# Altium schematic sheet STM32原理图.SchDoc
size A3
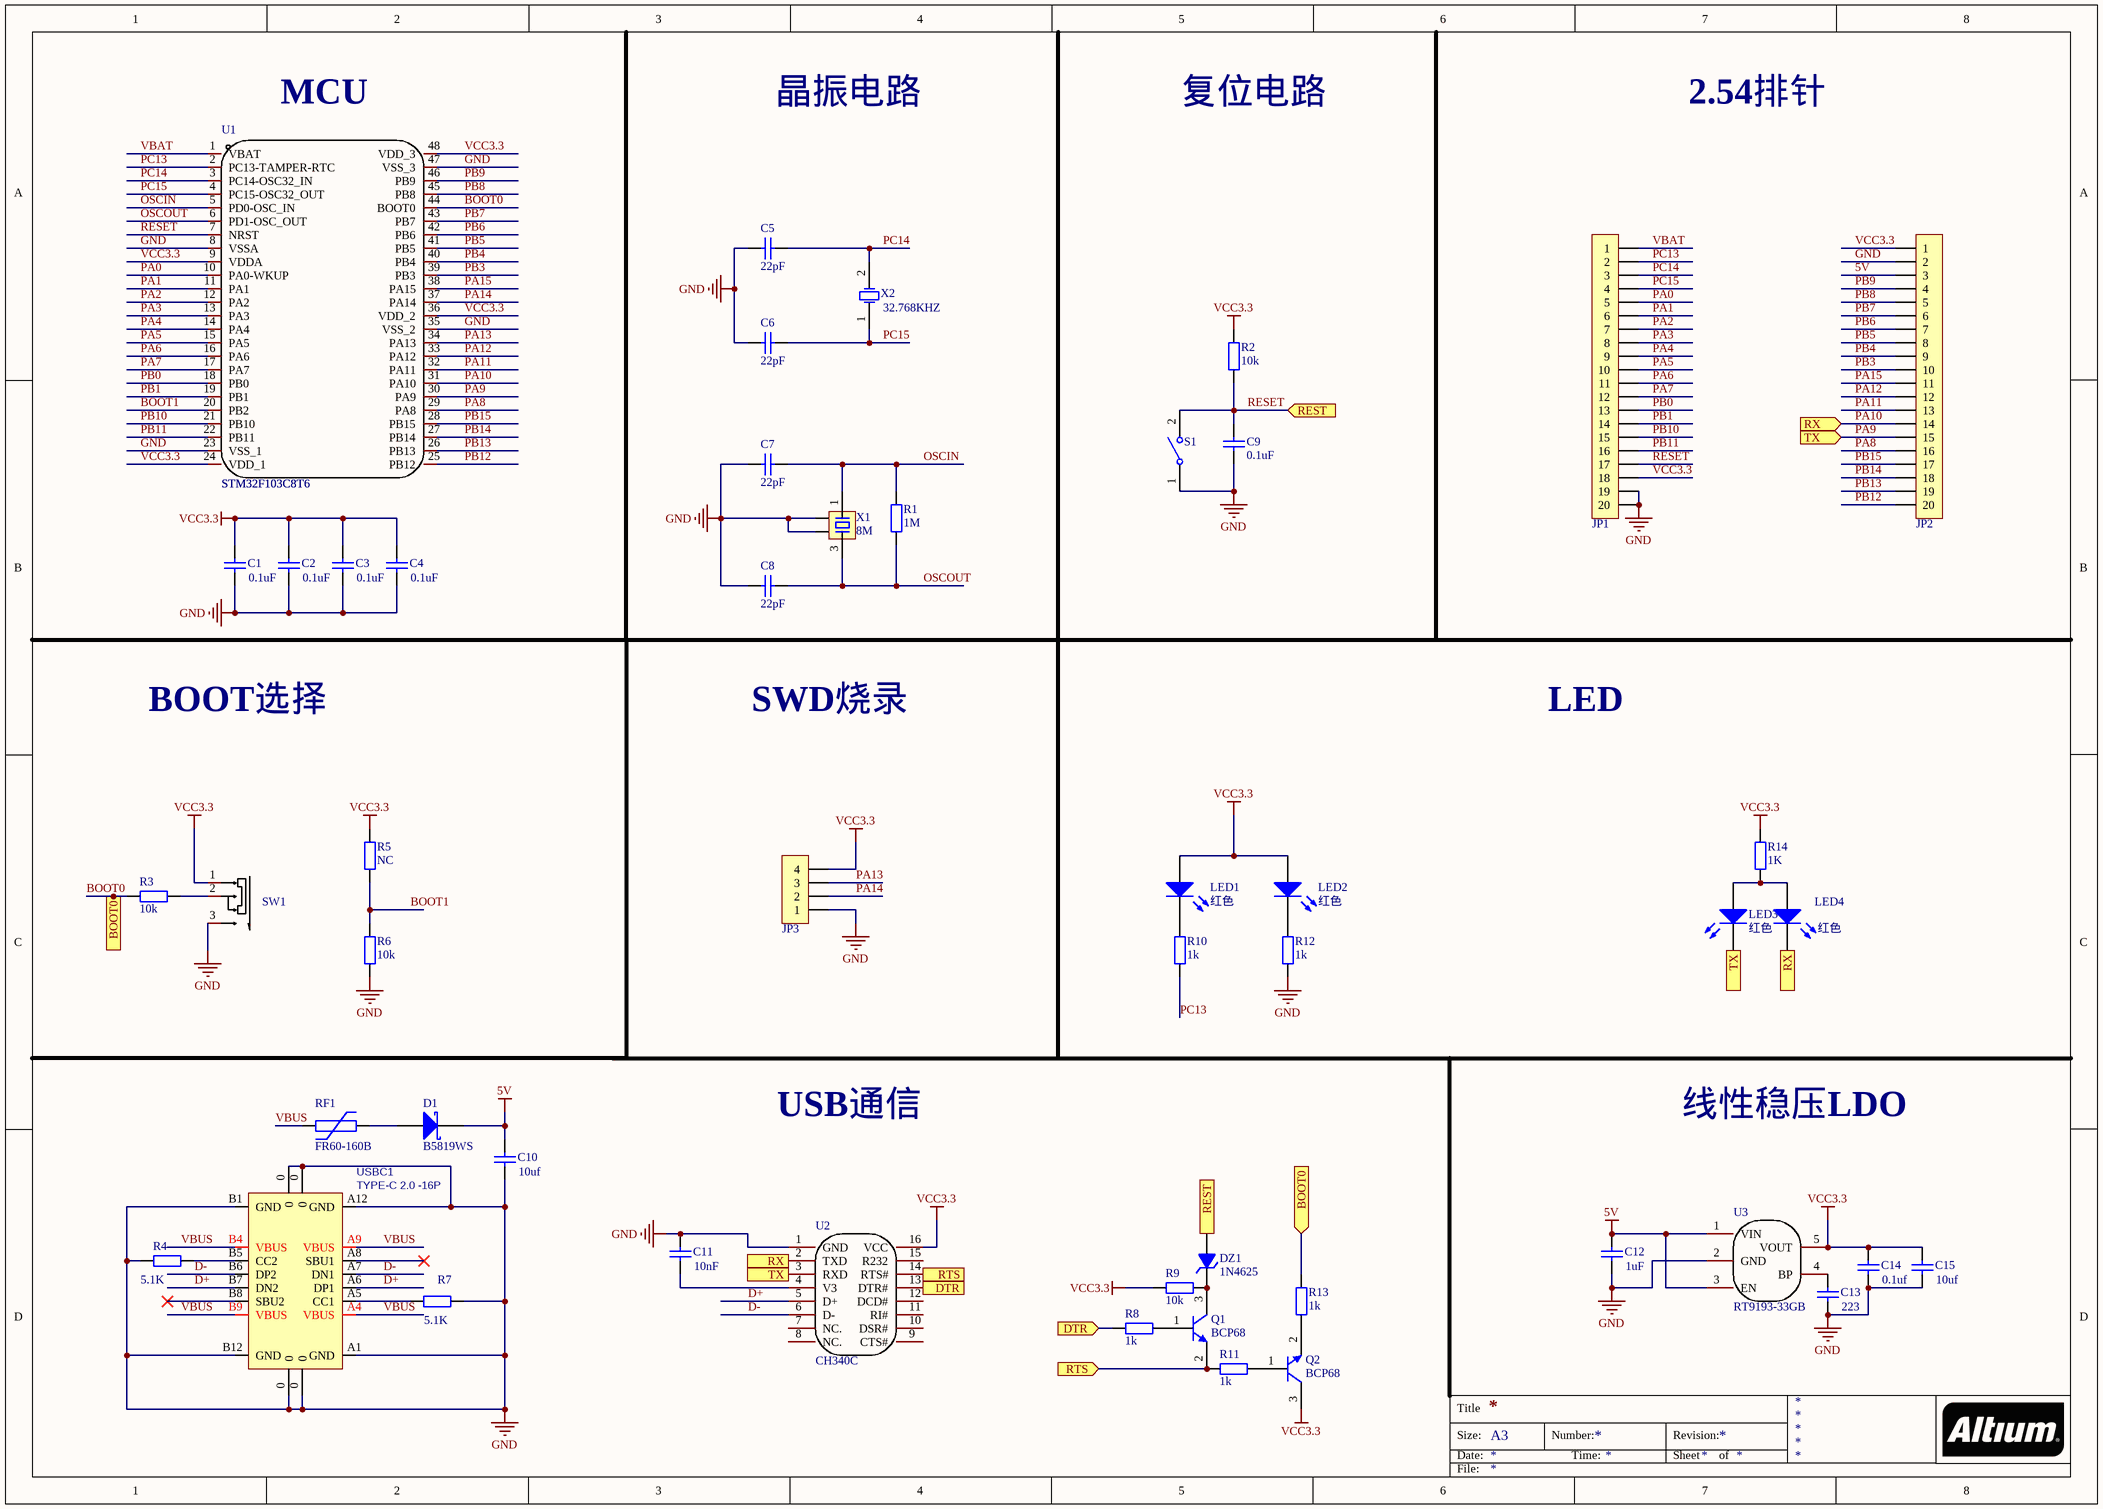
[diagram p0: STM32原理图.SchDoc]

## Parts
C1  value 0.1uF  [C0805_L]  (hidden comment: Cap)
C2  value 0.1uF  [C0805_L]  (hidden comment: Cap)
C3  value 0.1uF  [C0805_L]  (hidden comment: Cap)
C4  value 0.1uF  [C0805_L]  (hidden comment: Cap)
C5  value 22pF  [C0603_L]  (hidden comment: Cap)
C6  value 22pF  [C0603_L]  (hidden comment: Cap)
C7  value 22pF  [C0603_L]  (hidden comment: Cap)
C8  value 22pF  [C0603_L]  (hidden comment: Cap)
C9  value 0.1uF  [C0805_L]  (hidden comment: Cap)
C10  value 10uf  [C0402_M]  (hidden comment: Cap)
C11  value 10nF  [C0402_M]  (hidden comment: Cap)
C12  value 1uF  [C0805_L]  (hidden comment: Cap)
C13  value 223  [C0805_L]  (hidden comment: Cap)
C14  value 0.1uf  [C0603_L]  (hidden comment: Cap)
C15  value 10uf  [C0402_M]  (hidden comment: Cap)
D1  B5819WS  [SOD-323]
DZ1  1N4625  [SOT323]
JP1  HDR-1X20  [HDR2.54-LI-20P]  (value not drawn)
JP2  HDR-1X20  [HDR2.54-LI-20P]  (value not drawn)
JP3  CON-4P  [HDR2.54-M-LI-4P]  (value not drawn)
LED1  红色  [LED0603_Y]
LED2  红色  [LED0603_Y]
LED3  红色  [LED0603_Y]
LED4  红色  [LED0603_G]
Q1  BCP68  [SOT23-3M]
Q2  BCP68  [SOT23-3M]
R1  1M  [R0603_M]
R2  10k  [R0603_M]
R3  10k  [R0603_M]
R4  5.1K  [R0603_M]
R5  NC  [R0603_M]
R6  10k  [R0603_M]
R7  5.1K  [R0603_M]
R8  1k  [R0603_M]
R9  10k  [R0603_M]
R10  1k  [R0402_NS]
R11  1k  [R0603_M]
R12  1k  [R0402_NS]
R13  1k  [R0603_M]
R14  1K  [R0402_NS]
RF1  FR60-160B  [FU 1812]
S1  KCD1-101  [SW SMD-3*6*2.5]  (value not drawn)
SW1  MSS3-Q-T/R  [MSS3-Q-T/R]  (value not drawn)
U1  STM32F103C8T6  [STM32F103C8T6-D]
U2  CH340C  [SOP-16_L10.0-W3.9-P1.27-LS6.0-BL]
U3  RT9193-33GB  [SOT-23-5_L3.0-W1.7-P0.95-LS2.8-BR]
USBC1  TYPE-C 2.0 -16P  [USB-C-SMD_16P]
X1  8M  [XTAL-5032-4P]
X2  32.768KHZ  [XTAL-3215-2P]

## Ports
BOOT0 (in), DTR (in), REST (in), RTS (in), RX (in), TX (in)

## Nets
5V: C10.2 C12.2 D1.2(K) JP2.3 U3.1(VIN) U3.3(EN)
GND: C1.1 C2.1 C3.1 C4.1 C5.2 C6.2 C7.2 C8.2 C9.2 C10.1 C11.2 C12.1 C13.1 C14.1 C15.1 JP1.19 JP1.20 JP2.2 JP3.1 R4.1 R6.2 R7.2 R12.2 S1.1 SW1.3 U1.8(VSSA) U1.23(VSS_1) U1.35(VSS_2) U1.47(VSS_3) U2.1(GND) U3.2(GND) USBC1.0 USBC1.A1(GND) USBC1.A12(GND) USBC1.B1(GND) USBC1.B12(GND) X1.2 X1.4
VCC3.3: C1.2 C2.2 C3.2 C4.2 C14.2 C15.2 JP1.18 JP2.1 JP3.4 LED1.1(A) LED2.1(A) Q2.3(C) R2.2 R5.1 R9.1 R14.1 SW1.1 U1.9(VDDA) U1.24(VDD_1) U1.36(VDD_2) U1.48(VDD_3) U2.16(VCC) U3.5(VOUT)
BOOT0: R3.2 R13.2 U1.44(BOOT0) ; port BOOT0
BOOT1: R5.2 R6.1 U1.20(PB2)
D+: U2.5(D+) USBC1.A6(DP1) USBC1.B7(DN2)
D-: U2.6(D-) USBC1.A7(DN1) USBC1.B6(DP2)
DTR: R8.1 U2.13(DTR#) ; port DTR
OSCIN: C7.1 R1.2 U1.5(PD0-OSC_IN) X1.1
OSCOUT: C8.1 R1.1 U1.6(PD1-OSC_OUT) X1.3
PA0: JP1.5 U1.10(PA0-WKUP)
PA1: JP1.6 U1.11(PA1)
PA2: JP1.7 U1.12(PA2)
PA3: JP1.8 U1.13(PA3)
PA4: JP1.9 U1.14(PA4)
PA5: JP1.10 U1.15(PA5)
PA6: JP1.11 U1.16(PA6)
PA7: JP1.12 U1.17(PA7)
PA8: JP2.16 U1.29(PA8)
PA9: JP2.15 LED3.2(K) U1.30(PA9) U2.3(RXD) ; port TX
PA10: JP2.14 LED4.2(K) U1.31(PA10) U2.2(TXD) ; port RX
PA11: JP2.13 U1.32(PA11)
PA12: JP2.12 U1.33(PA12)
PA13: JP3.3 U1.34(PA13)
PA14: JP3.2 U1.37(PA14)
PA15: JP2.11 U1.38(PA15)
PB0: JP1.13 U1.18(PB0)
PB1: JP1.14 U1.19(PB1)
PB3: JP2.10 U1.39(PB3)
PB4: JP2.9 U1.40(PB4)
PB5: JP2.8 U1.41(PB5)
PB6: JP2.7 U1.42(PB6)
PB7: JP2.6 U1.43(PB7)
PB8: JP2.5 U1.45(PB8)
PB9: JP2.4 U1.46(PB9)
PB10: JP1.15 U1.21(PB10)
PB11: JP1.16 U1.22(PB11)
PB12: JP2.20 U1.25(PB12)
PB13: JP2.19 U1.26(PB13)
PB14: JP2.18 U1.27(PB14)
PB15: JP2.17 U1.28(PB15)
PC13: JP1.2 R10.2 U1.2(PC13-TAMPER-RTC)
PC14: C5.1 JP1.3 U1.3(PC14-OSC32_IN) X2.2(OSC2)
PC15: C6.1 JP1.4 U1.4(PC15-OSC32_OUT) X2.1(OSC1)
RESET: C9.1 DZ1.1(A) JP1.17 R2.1 S1.2 U1.7(NRST) ; port REST
RTS: Q1.2(E) R11.1 U2.14(RTS#) ; port RTS
VBAT: JP1.1 U1.1(VBAT)
VBUS: RF1.1 USBC1.A4(VBUS) USBC1.A9(VBUS) USBC1.B4(VBUS) USBC1.B9(VBUS)
NetC11_1: C11.1 U2.4(V3)
NetC13_2: C13.2 U3.4(BP)
NetD1_1: D1.1(A) RF1.2
NetDZ1_2: DZ1.2(K) Q1.3(C) R9.2
NetLED1_2: LED1.2(K) R10.1
NetLED2_2: LED2.2(K) R12.1
NetLED3_1: LED3.1(A) LED4.1(A) R14.2
NetQ1_1: Q1.1(B) R8.2
NetQ2_1: Q2.1(B) R11.2
NetQ2_2: Q2.2(E) R13.1
NetR3_1: R3.1 SW1.2
NetR4_2: R4.2 USBC1.B5(CC2)
NetR7_1: R7.1 USBC1.A5(CC1)

Not connected (* = marked no-connect by the designer): U2 7(NC.) 8(NC.) 9(CTS#) 10(DSR#) 11(RI#) 12(DCD#) 15(R232); USBC1 A8(SBU1)* B8(SBU2)*

## Notes on the sheet
- (near U1) MCU
- 晶振电路
- 复位电路
- 2.54排针
- BOOT选择
- SWD烧录
- LED
- USB通信
- 线性稳压LDO
- Title
- Size:
- Date:
- A3
- Number:
- Time:
- Revision:
- Sheet
- of
- File:

## Library data of the parts
C1-C15 = Cap: Capacitor; Published: 8-Jun-2000; LatestRevisionDate: 17-Jul-2002; LatestRevisionNote: Re-released for DXP Platform.; PackageReference: RAD-0.3; Publisher: Altium Limited; PackageDescription: Radial Cap, Thru-Hole; 2 Leads; 0.3 in Pin Spacing
D1 = 1N5819: 肖特基二极管; 以赠品形式获赠本封装库的买家，还可联系卖家免费指导AD软件使用: 封装库来自淘宝卖家ID：黄晶宝石; BOM名称: 肖特基二极管
DZ1 = 1N4625: 5.1V/0.5W稳压管; 以赠品形式获赠本封装库的买家，还可联系卖家免费指导AD软件使用: 封装库来自淘宝卖家ID：黄晶宝石; BOM名称: 5.1V/0.5W稳压管
JP1 JP2 = Header 20: 20P接插件; 联系卖家，免费查找封装: 唯一出售店铺网址https://shop463601444.taobao.com; 封装库来自淘宝卖家ID：黄晶宝石: 其他店铺购入均为盗版封装库，请立即申请退款，本店现金奖励50~200元; BOM名称: 20P接插件
JP3 = Header 4: 4P连接器; 联系卖家 免费查找封装: 唯一出售店铺网址https://shop463601444.taobao.com; 联系卖家 免费技术支持: 封装库来自淘宝卖家ID：黄晶宝石; BOM名称: 4P连接器
LED1-LED4 = LED: 贴片LED; 封装库来自淘宝卖家：黄晶宝石: 其他店铺购入均为盗版封装库，请立即申请退款，本店现金奖励200~1000元; BOM名称: 贴片LED
Q1 Q2 = BCP68: NPN三极管; 8元以下特价购入的买家: 还可以联系卖家远程指导AD软件使用
R1-R14 = R: 贴片电阻; 联系下单店铺卖家 免费帮你查找封装: 联系下单店铺卖家 免费技术支持; BOM名称: 贴片电阻
RF1 = FU-PPTC: PPTC自恢复保险丝; 联系卖家，免费查找封装: 唯一出售店铺网址https://shop463601444.taobao.com; 封装库来自淘宝卖家：黄晶宝石: 其他店铺购入均为盗版封装库，请立即申请退款，本店现金奖励200~1000元; BOM名称: PPTC自恢复保险丝
S1 = KCD1-101: 1路单刀船型开关; 联系卖家，免费查找封装: 唯一出售店铺网址https://shop463601444.taobao.com; 封装库来自淘宝卖家：黄晶宝石: 其他店铺购入均为盗版封装库，请立即申请退款，本店现金奖励200~1000元; BOM名称: 1路单刀船型开关
SW1 = MSS3-Q-T/R: 额定电流(DC):25mA;额定电压(DC):24V;额定电流(AC):-;额定电压(AC):-;电路结构:单刀双掷;安装方式:卧贴;机械寿命:10000;滑钮形状:矩形柱状;引脚样式:SMD接片;工作温度:-20~+70;开关高度:-;; Manufacturer: 台湾圜达; Add into BOM: yes; Current Rating (DC): 25mA; Voltage Rating (DC): 24V; Circuit: 单刀双掷; Mechanical Life: 10000; Actuator Style: 矩形柱状; Pin Style: SMD接片; Symbol: MSS3-Q-T/R; Device: MSS3-Q-T/R; LCSC Part Name: MSS3-Q-T/R; Supplier Part: C240299; Manufacturer Part: MSS3-Q-T/R; Supplier Footprint: SMD; JLCPCB Part Class: Extended Part; Datasheet: https://atta.szlcsc.com/upload/public/pdf/source/20180719/C240299_509343338DDAA4426612AF8E71B037F5.pdf; Supplier: LCSC; Convert to PCB: yes; Current Rating (AC): -; Voltage Rating (AC): -; Mounting Style: 卧贴; Operating Temperature: -20~+70; Switch Height: -
U1 = STM32F103C8T6: CPU内核:ARM Cortex-M3;CPU最大主频:72MHz;工作电压范围:2V~3.6V;内部振荡器:有;程序 FLASH容量:64K@x8bit;RAM总容量:20KB;EEPROM/数据 FLASH容量:-;GPIO端口数量:37;ADC(单元数/通道数/位数):1@x10ch/12bit;外设/功能/协议栈:温度传感器；DMA；看门狗；POR；PWM;工作温度范围:-40~+85;; Manufacturer: ST(意法半导体); Add into BOM: yes; Maximum Frequency: 72MHz; Internal Oscillator: 有; RAM Size: 20KB; GPIO Ports Number: 37; Name: STM32F103C8T6; Symbol: STM32F103C8T6; Device: STM32F103C8T6; LCSC Part Name: STM32F103C8T6 MSL=3; Supplier Part: C8734; Manufacturer Part: STM32F103C8T6; Supplier Footprint: LQFP-48_7x7x05P; JLCPCB Part Class: Basic Part; Datasheet: https://atta.szlcsc.com/upload/public/pdf/source/20140724/1457707174202.pdf; Supplier: LCSC; Convert to PCB: yes; CPU Core: ARM Cortex-M3; Supply Voltage Range: 2V~3.6V; Program FLASH Size: 64K@x8bit; EEPROM/Data FLASH Size: -; ADC (Units/Channels/bits): 1@x10ch/12bit; Peripherals / Functions / Protocol Stacks: 温度传感器；DMA；看门狗；POR；PWM; Operating Temperature Range: -40~+85
U2 = CH340C: 类型:Transceiver;协议类别:USB 2.0;驱动器/接收器数:-;数据速率:2Mbps;; Manufacturer: WCH(南京沁恒); Add into BOM: yes; Protocol: USB 2.0; Data Rate: 2Mbps; Supply Voltage: 3.3V, 5V; Symbol: CH340C; Device: CH340C; LCSC Part Name: CH340C; Supplier Part: C84681; Manufacturer Part: CH340C; Supplier Footprint: SOP-16_150mil; JLCPCB Part Class: Extended Part; Datasheet: https://atta.szlcsc.com/upload/public/pdf/source/20200819/C84681_ADBED554CE321879DBD6B1D06488689C.pdf; Supplier: LCSC; Convert to PCB: yes; Type: Transceiver; Number of Drivers/Receivers: -; Name: CH340C
U3 = RT9193-33GB: 输出类型:固定;输出极性:正;输出通道数:1;最大输入电压:5.5V;输出电压:3.3V;压差:300mV@(300mA);输出电流:300mA;电源纹波抑制比(PRSS):70dB@(100Hz),50dB@(10kHz);; Manufacturer: RICHTEK(台湾立锜); Add into BOM: yes; Output Type: 固定; Output Polarity: 正; Number of Outputs: 1; Maximum Input Voltage: 5.5V; Output Voltage: 3.3V; Symbol: RT9193-33GB; Device: RT9193-33GB; LCSC Part Name: Vin=5.5V Vout=3.3V 300mA 70dB@(100Hz),50dB@(10kHz); Supplier Part: C15651; Manufacturer Part: RT9193-33GB; Supplier Footprint: SOT-23-5; JLCPCB Part Class: Extended Part; Datasheet: https://atta.szlcsc.com/upload/public/pdf/source/20130730/1457706628575.pdf; Supplier: LCSC; Convert to PCB: yes; Dropout Voltage: 300mV@(300mA); Output Current: 300mA; Power Supply Rejection Ratio (PRSS): 70dB@(100Hz),50dB@(10kHz); Name: RT9193-33GB
USBC1 = USB2.0_Type-C_16Pin: USB2.0_Type-C_16Pin母座; 联系下单店铺卖家 免费帮你查找封装: 封装库来自淘宝卖家ID：黄晶宝石
X1 = XTAL-4P: 4脚无源晶振(谐振器）; 联系下单店铺卖家 免费帮你查找封装: 联系下单店铺卖家 免费技术支持; BOM名称: 4脚无源晶振(谐振器）
X2 = XTAL: Crystal Oscillator; Published: 8-Jun-2000; LatestRevisionDate: 17-Jul-2002; LatestRevisionNote: Re-released for DXP Platform.; PackageReference: R38; Publisher: Altium Limited; PackageDescription: Crystal, Thru-Hole; 2 Leads; Body 3.1 x 8.2 mm (Dia.xH)